# EasyEDA Pro project Clock_EasyEDA_Project_File.epro, schematic Clock

## Sheets
1 MCU: Board Name: Clock; Create Date: 2025-06-09; Page Name: MCU; Project Name: Clock; Schematic Name: Clock; Update Date: 2025-06-10; Company: (C) FEDEVEL 2025; Drawn: Robert Feranec; Page Size: A3; Part Number: JLCPCB-002; Reviewed: EasyEDA; Version: V1I1
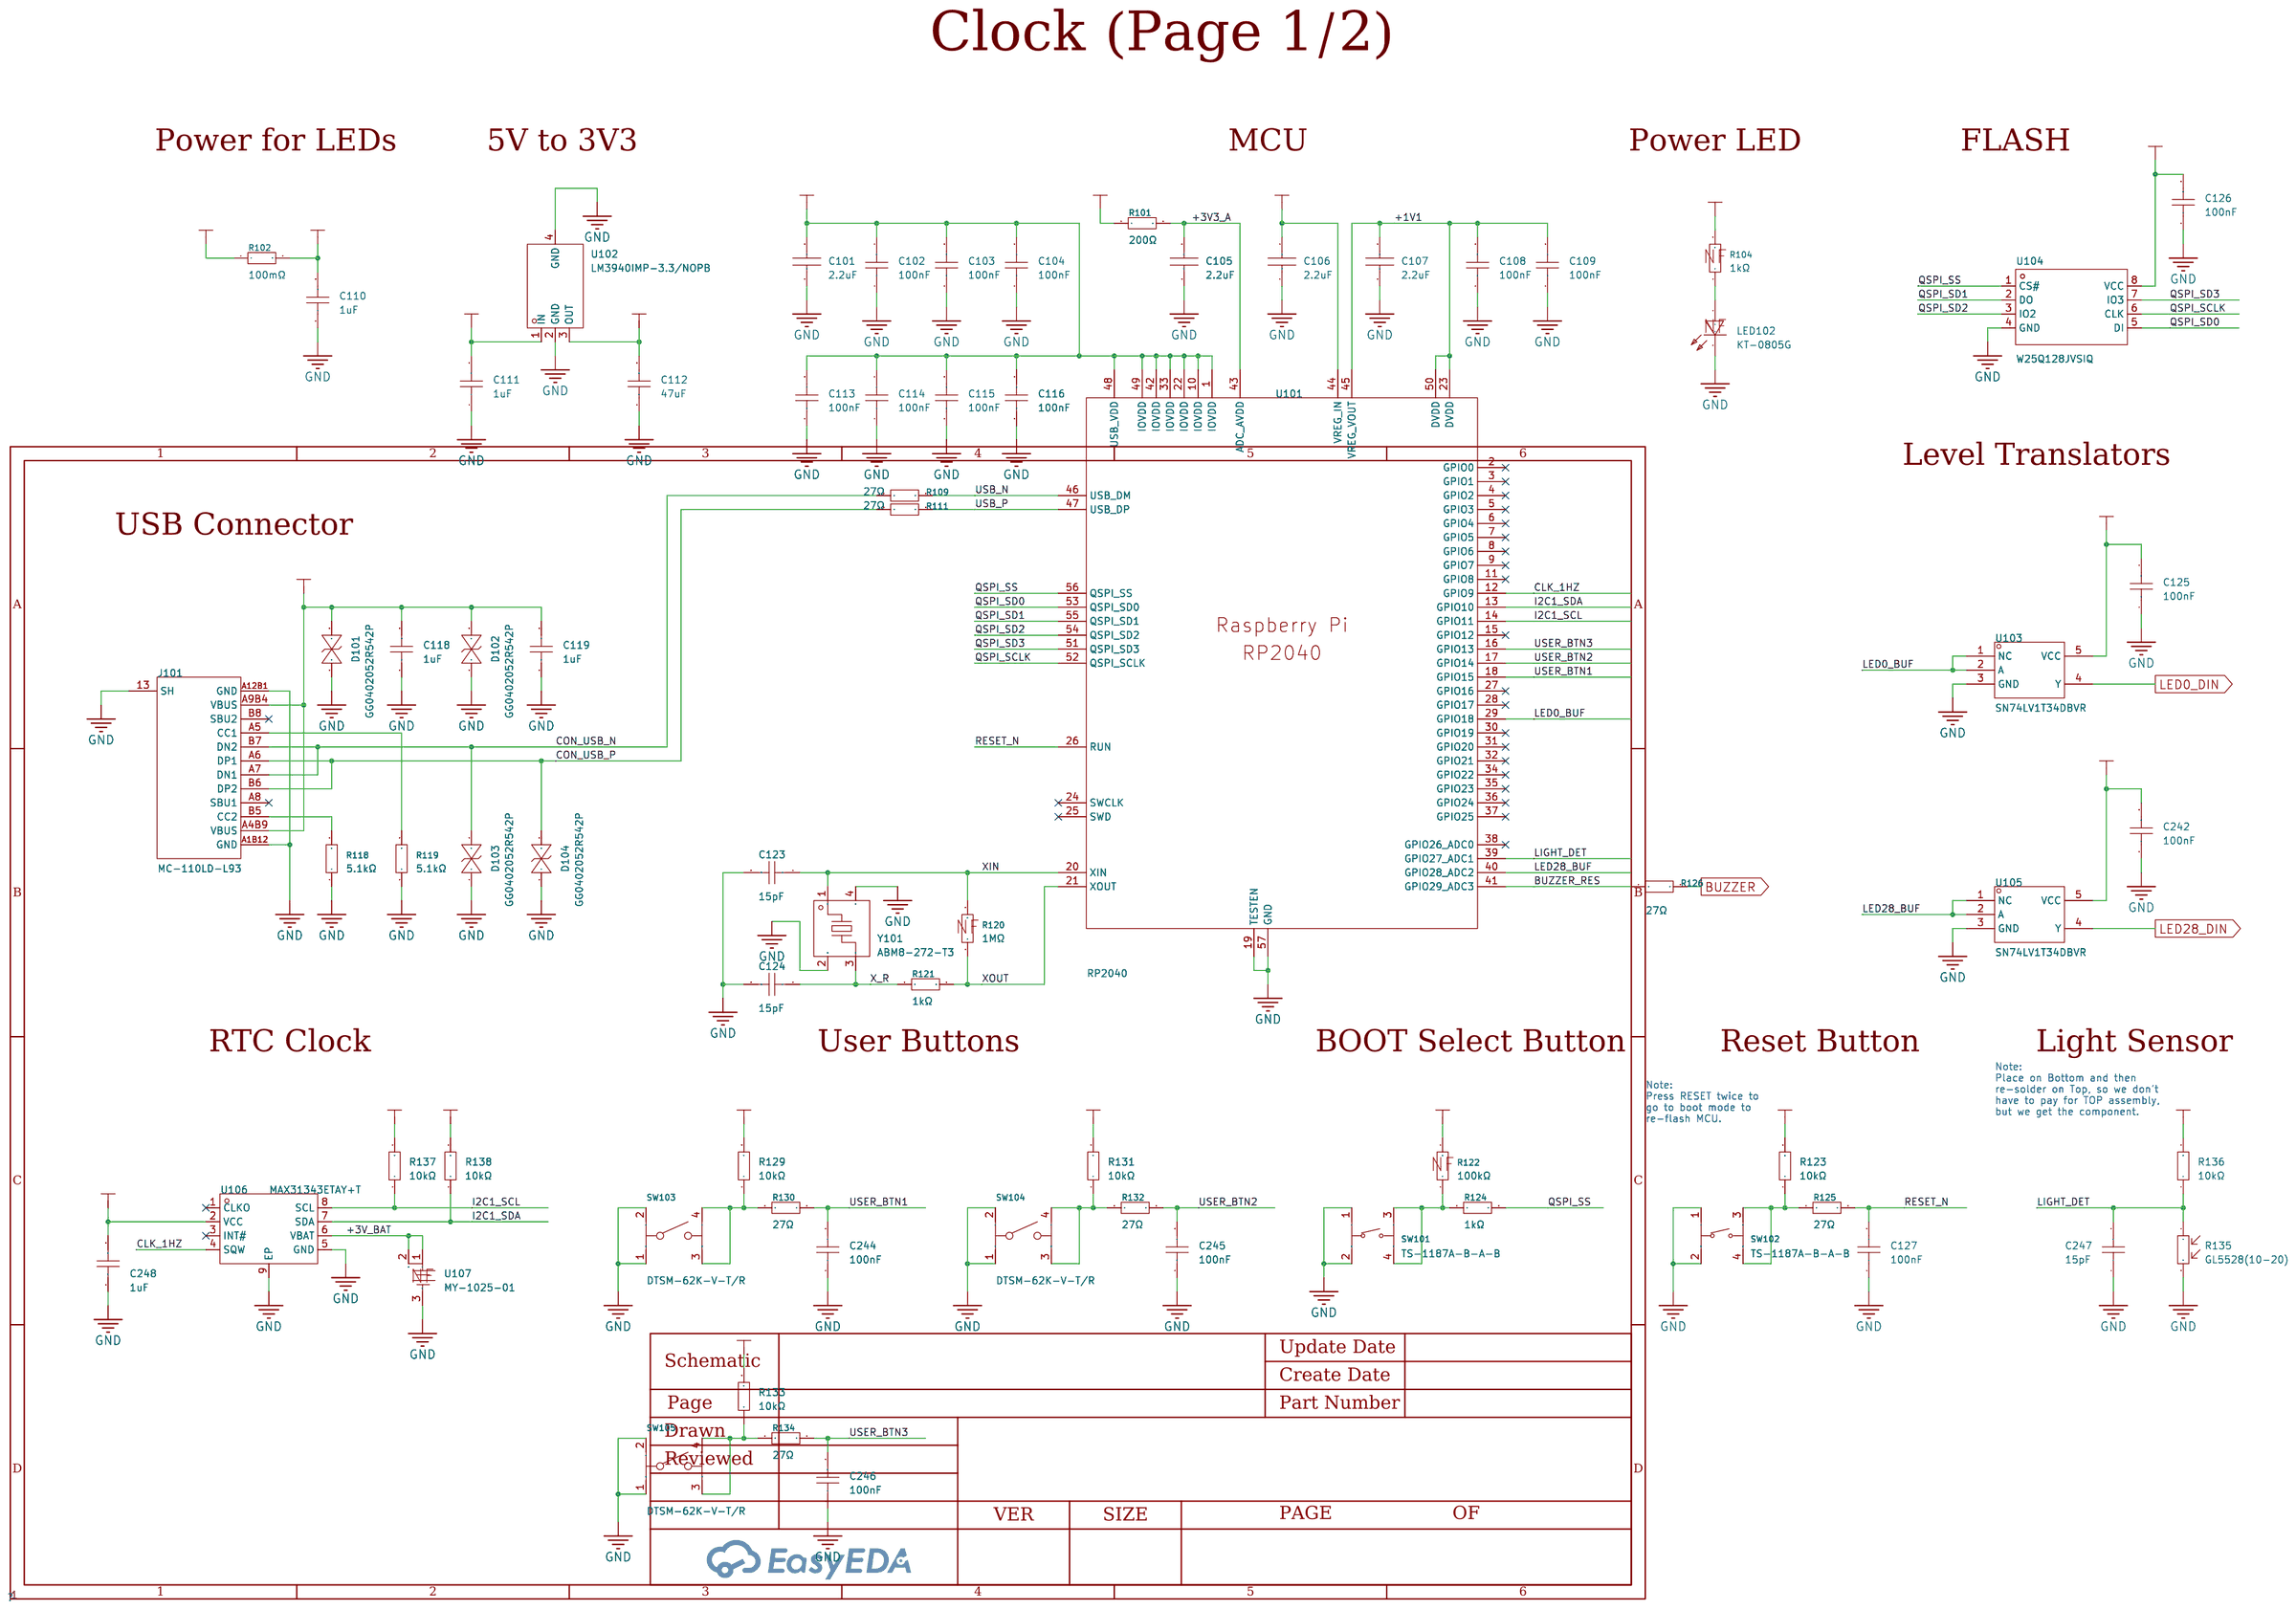
[diagram p0: MCU]
2 OTHER: Page Name: OTHER
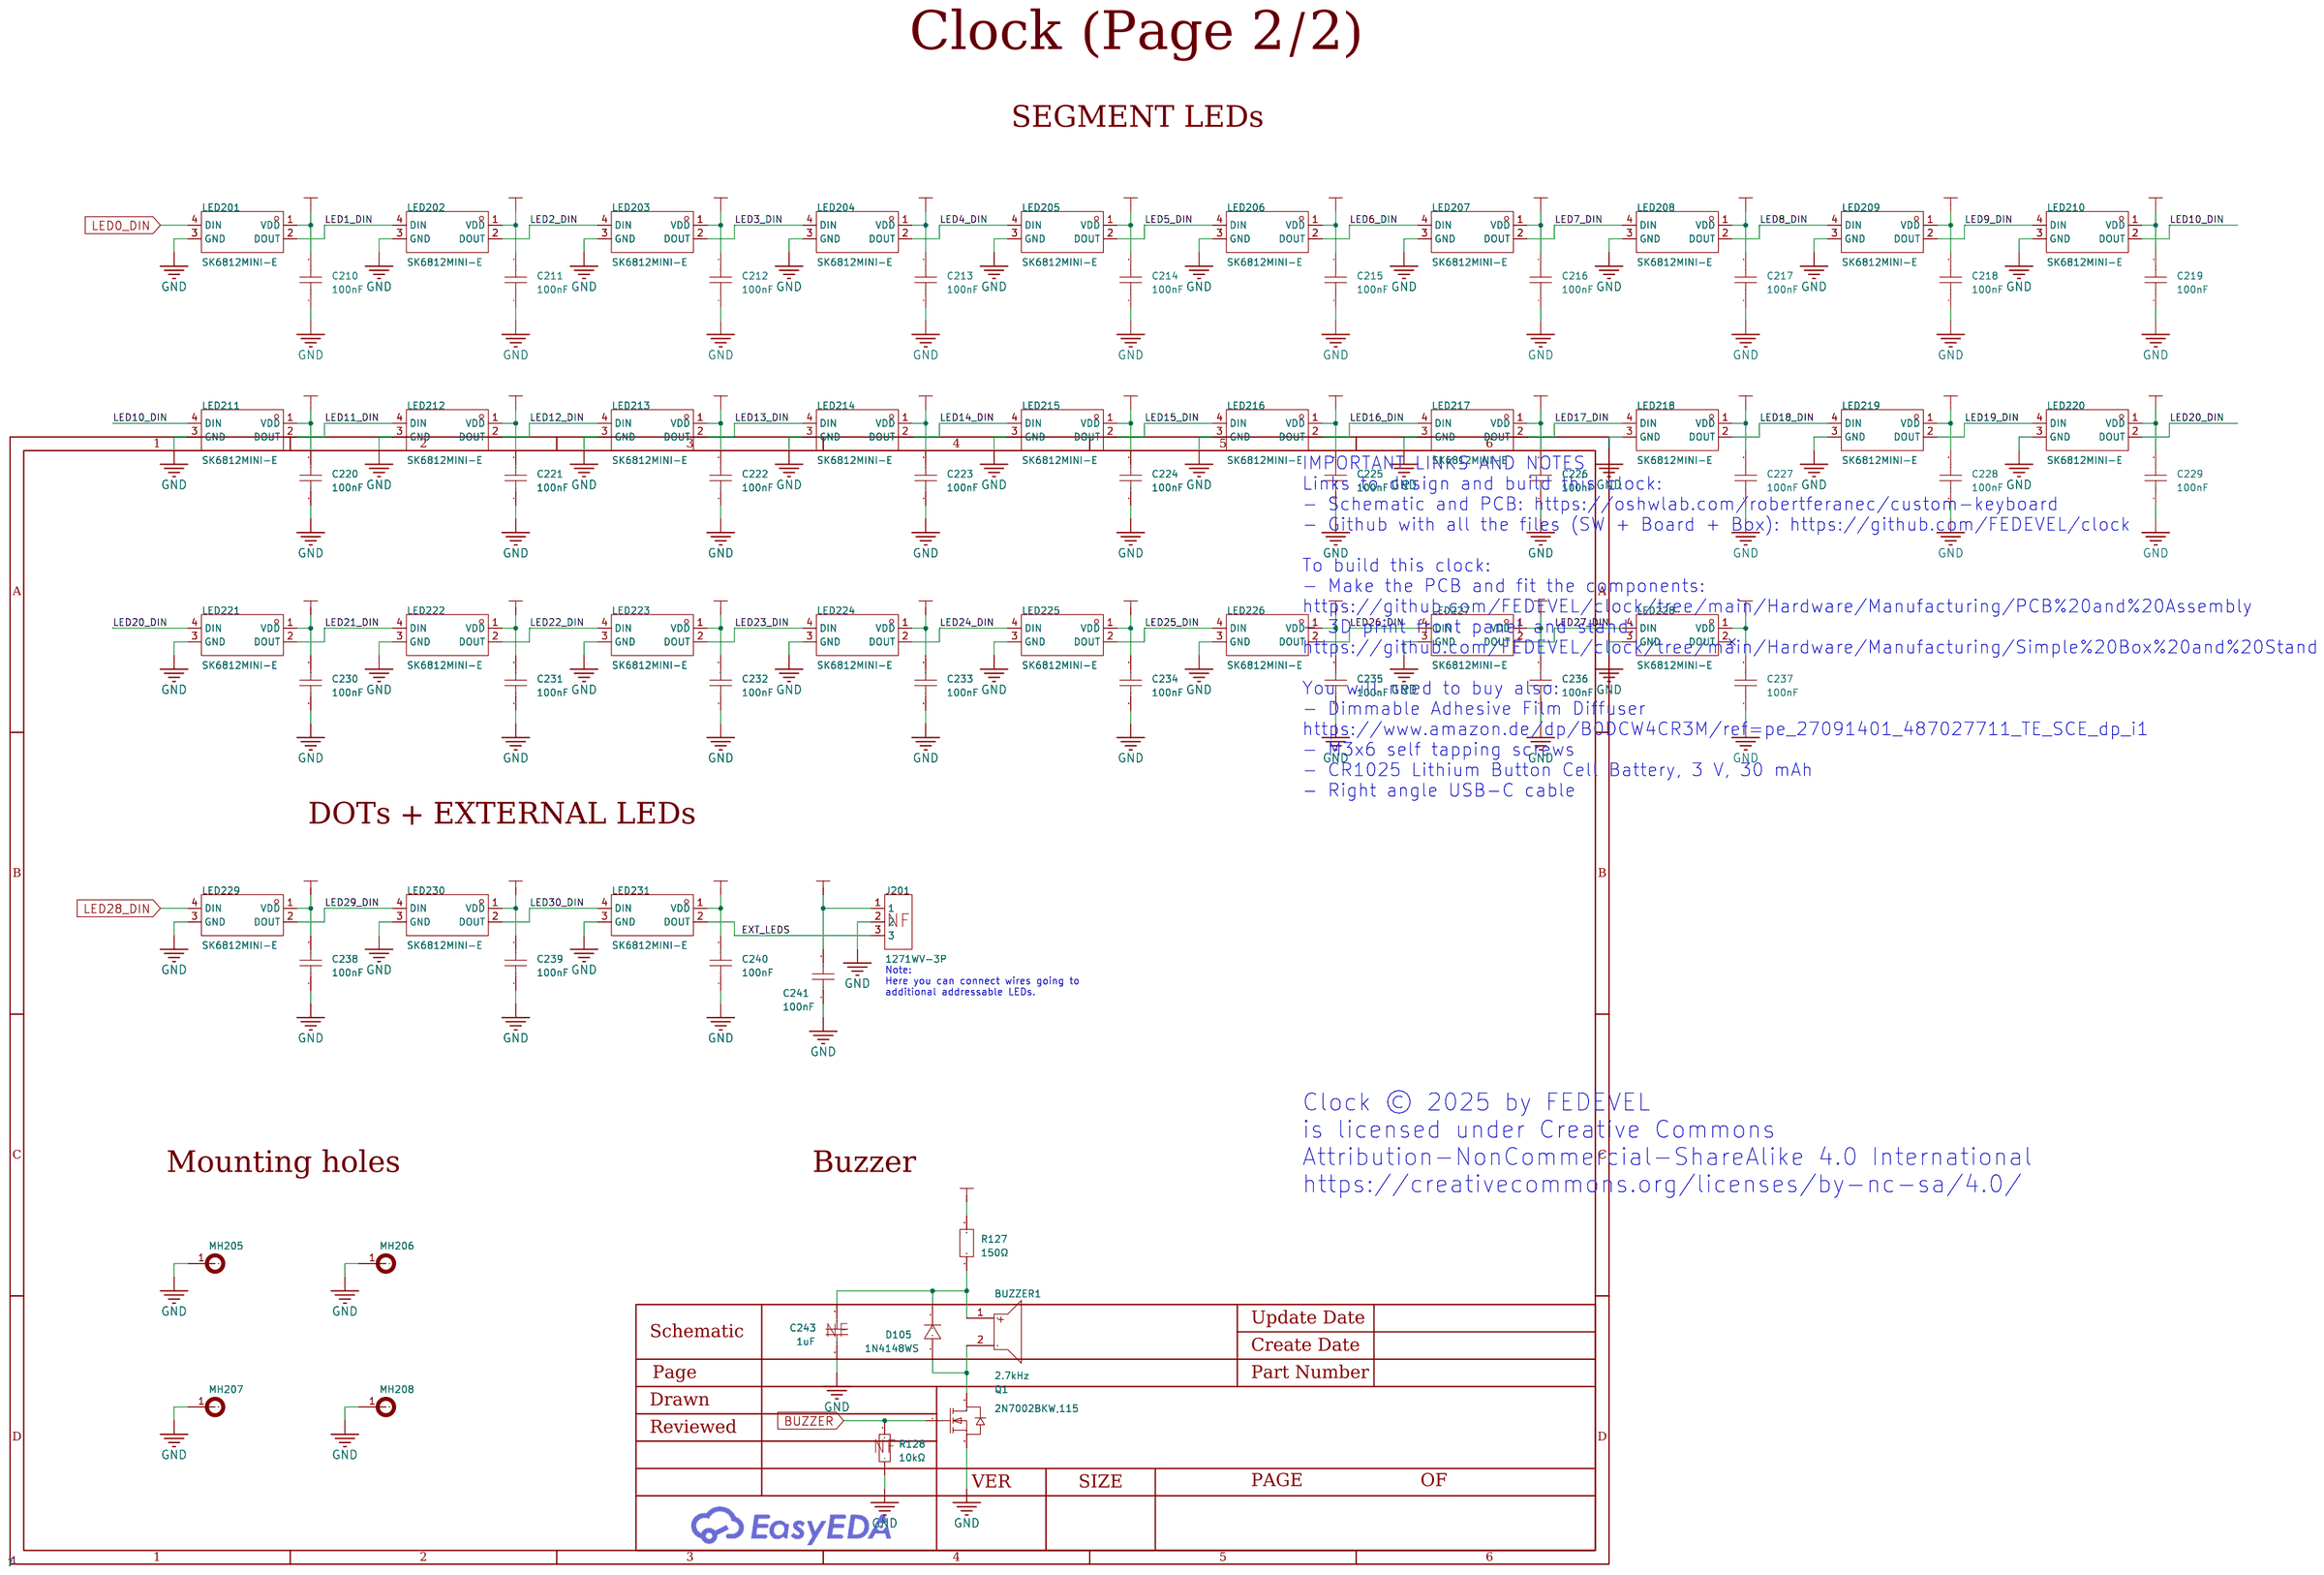
[diagram p1: OTHER]

## Parts
sheet MCU
C101  2.2uF  [C0402]
C102  100nF  [C0402]
C103  100nF  [C0402]
C104  100nF  [C0402]
C105  2.2uF  [C0402]
C106  2.2uF  [C0402]
C107  2.2uF  [C0402]
C108  100nF  [C0402]
C109  100nF  [C0402]
C110  1uF  [C0402]
C111  1uF  [C0402]
C112  47uF  [C1206]
C113  100nF  [C0402]
C114  100nF  [C0402]
C115  100nF  [C0402]
C116  100nF  [C0402]
C118  1uF  [C0402]
C119  1uF  [C0402]
C123  15pF  [C0402]
C124  15pF  [C0402]
C125  100nF  [C0402]
C126  100nF  [C0402]
C127  100nF  [C0402]
C242  100nF  [C0402]
C244  100nF  [C0402]
C245  100nF  [C0402]
C246  100nF  [C0402]
C247  15pF  [C0402]
C248  1uF  [C0402]
D101  GG0402052R542P  [D0402-BI]
D102  GG0402052R542P  [D0402-BI]
D103  GG0402052R542P  [D0402-BI]
D104  GG0402052R542P  [D0402-BI]
J101  MC-110LD-L93  [USB-C-TH_MC-110LD-L93_1]
LED102  KT-0805G  [LED0805-R-RD]  (no BOM)
R101  200Ω  [R0402]
R102  100mΩ  [R1206]
R104  1kΩ  [R0402]  (no BOM)
R109  27Ω  [R0402]
R111  27Ω  [R0402]
R118  5.1kΩ  [R0402]
R119  5.1kΩ  [R0402]
R120  1MΩ  [R0402]  (no BOM)
R121  1kΩ  [R0402]
R122  100kΩ  [R0402]  (no BOM)
R123  10kΩ  [R0402]
R124  1kΩ  [R0402]
R125  27Ω  [R0402]
R126  27Ω  [R0402]
R129  10kΩ  [R0402]
R130  27Ω  [R0402]
R131  10kΩ  [R0402]
R132  27Ω  [R0402]
R133  10kΩ  [R0402]
R134  27Ω  [R0402]
R135  GL5528(10-20)  [RES-TH_L5.1-W4.3-P3.40-D0.5]
R136  10kΩ  [R0402]
R137  10kΩ  [R0402]
R138  10kΩ  [R0402]
SW101  TS-1187A-B-A-B  [SW-SMD_4P-L5.1-W5.1-P3.70-LS6.5-TL-2]
SW102  TS-1187A-B-A-B  [SW-SMD_4P-L5.1-W5.1-P3.70-LS6.5-TL-2]
SW103  DTSM-62K-V-T/R  [KEY-SMD_4P-L6.2-W6.2-P4.50-LS9.0]
SW104  DTSM-62K-V-T/R  [KEY-SMD_4P-L6.2-W6.2-P4.50-LS9.0]
SW105  DTSM-62K-V-T/R  [KEY-SMD_4P-L6.2-W6.2-P4.50-LS9.0]
U101  RP2040  [LQFN-56_L7.0-W7.0-P0.4-EP_1]
U102  LM3940IMP-3.3/NOPB  [SOT-223_L6.5-W3.5-P2.30-LS7.0-BR]
U103  SN74LV1T34DBVR  [SOT-23-5_L2.9-W1.6-P0.95-LS2.8-BR]
U104  W25Q128JVSIQ  [SOIC-8_L5.3-W5.3-P1.27-LS8.0-BL]
U105  SN74LV1T34DBVR  [SOT-23-5_L2.9-W1.6-P0.95-LS2.8-BR]
U106  MAX31343ETAY+T  [TDFN-8_L4.0-W3.0-P0.50-BL-EP]
U107  MY-1025-01  [BAT-SMD_MY-1025-01_1]  (no BOM)
Y101  ABM8-272-T3  [CRYSTAL-SMD_4P-L3.2-W2.5-BL]
sheet OTHER
BUZZER1  2.7kHz  [BUZ-TH_BD9.0-P4.00-D0.6-FD]
C210  100nF  [C0402]
C211  100nF  [C0402]
C212  100nF  [C0402]
C213  100nF  [C0402]
C214  100nF  [C0402]
C215  100nF  [C0402]
C216  100nF  [C0402]
C217  100nF  [C0402]
C218  100nF  [C0402]
C219  100nF  [C0402]
C220  100nF  [C0402]
C221  100nF  [C0402]
C222  100nF  [C0402]
C223  100nF  [C0402]
C224  100nF  [C0402]
C225  100nF  [C0402]
C226  100nF  [C0402]
C227  100nF  [C0402]
C228  100nF  [C0402]
C229  100nF  [C0402]
C230  100nF  [C0402]
C231  100nF  [C0402]
C232  100nF  [C0402]
C233  100nF  [C0402]
C234  100nF  [C0402]
C235  100nF  [C0402]
C236  100nF  [C0402]
C237  100nF  [C0402]
C238  100nF  [C0402]
C239  100nF  [C0402]
C240  100nF  [C0402]
C241  100nF  [C0402]
C243  1uF  [C0402]  (no BOM)
D105  1N4148WS  [SOD-323_L1.8-W1.3-LS2.5-RD]
J201  1271WV-3P  [HDR-TH_3P-P1.27-V-M]  (no BOM)
LED201  SK6812MINI-E  [LED-SMD_L3.2-W2.8-TR]
LED202  SK6812MINI-E  [LED-SMD_L3.2-W2.8-TR]
LED203  SK6812MINI-E  [LED-SMD_L3.2-W2.8-TR]
LED204  SK6812MINI-E  [LED-SMD_L3.2-W2.8-TR]
LED205  SK6812MINI-E  [LED-SMD_L3.2-W2.8-TR]
LED206  SK6812MINI-E  [LED-SMD_L3.2-W2.8-TR]
LED207  SK6812MINI-E  [LED-SMD_L3.2-W2.8-TR]
LED208  SK6812MINI-E  [LED-SMD_L3.2-W2.8-TR]
LED209  SK6812MINI-E  [LED-SMD_L3.2-W2.8-TR]
LED210  SK6812MINI-E  [LED-SMD_L3.2-W2.8-TR]
LED211  SK6812MINI-E  [LED-SMD_L3.2-W2.8-TR]
LED212  SK6812MINI-E  [LED-SMD_L3.2-W2.8-TR]
LED213  SK6812MINI-E  [LED-SMD_L3.2-W2.8-TR]
LED214  SK6812MINI-E  [LED-SMD_L3.2-W2.8-TR]
LED215  SK6812MINI-E  [LED-SMD_L3.2-W2.8-TR]
LED216  SK6812MINI-E  [LED-SMD_L3.2-W2.8-TR]
LED217  SK6812MINI-E  [LED-SMD_L3.2-W2.8-TR]
LED218  SK6812MINI-E  [LED-SMD_L3.2-W2.8-TR]
LED219  SK6812MINI-E  [LED-SMD_L3.2-W2.8-TR]
LED220  SK6812MINI-E  [LED-SMD_L3.2-W2.8-TR]
LED221  SK6812MINI-E  [LED-SMD_L3.2-W2.8-TR]
LED222  SK6812MINI-E  [LED-SMD_L3.2-W2.8-TR]
LED223  SK6812MINI-E  [LED-SMD_L3.2-W2.8-TR]
LED224  SK6812MINI-E  [LED-SMD_L3.2-W2.8-TR]
LED225  SK6812MINI-E  [LED-SMD_L3.2-W2.8-TR]
LED226  SK6812MINI-E  [LED-SMD_L3.2-W2.8-TR]
LED227  SK6812MINI-E  [LED-SMD_L3.2-W2.8-TR]
LED228  SK6812MINI-E  [LED-SMD_L3.2-W2.8-TR]
LED229  SK6812MINI-E  [LED-SMD_L3.2-W2.8-TR]
LED230  SK6812MINI-E  [LED-SMD_L3.2-W2.8-TR]
LED231  SK6812MINI-E  [LED-SMD_L3.2-W2.8-TR]
MH205  -  [MH_7.5X3.2MM_RF_v1.0]  (no BOM)
MH206  -  [MH_7.5X3.2MM_RF_v1.0]  (no BOM)
MH207  -  [MH_7.5X3.2MM_RF_v1.0]  (no BOM)
MH208  -  [MH_7.5X3.2MM_RF_v1.0]  (no BOM)
Q1  2N7002BKW,115  [SOT-323_L2.0-W1.3-P1.30-LS2.1-BR]
R127  150Ω  [R1206]
R128  10kΩ  [R0402]  (no BOM)

## Library data of the parts
C101 C105-C107 = CL05A225MQ5NSNC: Capacitance: Tolerance:±20% Tolerance:±20% Voltage Rated: Temperature Coefficient:; LCSC Part Name: 2.2uF ±20% 6.3V; Supplier Part: C12530; Manufacturer: SAMSUNG(三星); Supplier Footprint: 0402; JLCPCB Part Class: Basic Part; Datasheet: https://atta.szlcsc.com/upload/public/pdf/source/20160218/1457707763339.pdf; Supplier: LCSC; Tolerance: ±20%
C102-C104 C108 C109 C113-C116 C125-C127 C210-C242 C244-C246 = CL05B104KO5NNNC: Capacitance: Tolerance:±10% Tolerance:±10% Voltage Rated: Temperature Coefficient:; LCSC Part Name: 100nF ±10% 16V; Supplier Part: C1525; Manufacturer: SAMSUNG(三星); Supplier Footprint: 0402; JLCPCB Part Class: Basic Part; Datasheet: https://atta.szlcsc.com/upload/public/pdf/source/20160218/1457707763339.pdf; Supplier: LCSC; Tolerance: ±10%
C110 C111 C118 C119 C243 C248 = CL05A105KA5NQNC: Capacitance: Tolerance:±10% Tolerance:±10% Voltage Rated: Temperature Coefficient:; LCSC Part Name: 1uF ±10% 25V; Supplier Part: C52923; Manufacturer: SAMSUNG(三星); Supplier Footprint: 0402; JLCPCB Part Class: Basic Part; Datasheet: https://atta.szlcsc.com/upload/public/pdf/source/20160218/1457707763339.pdf; Supplier: LCSC; Tolerance: ±10%
C112 = CL31A476MPHNNNE: Capacitance: Tolerance:±20% Tolerance:±20% Voltage Rated: Temperature Coefficient:; LCSC Part Name: 47uF ±20% 10V; Supplier Part: C96123; Manufacturer: SAMSUNG(三星); Supplier Footprint: 1206; JLCPCB Part Class: Basic Part; Datasheet: https://atta.szlcsc.com/upload/public/pdf/source/20160218/1457707763339.pdf; Supplier: LCSC; Tolerance: ±20%
C123 C124 C247 = CL05C150JB5NNNC: Capacitance: Tolerance:±5% Tolerance:±5% Voltage Rated: Temperature Coefficient:; LCSC Part Name: 15pF ±5% 50V; Supplier Part: C86285; Manufacturer: SAMSUNG(三星); Supplier Footprint: 0402; JLCPCB Part Class: Extended Part; Datasheet: https://atta.szlcsc.com/upload/public/pdf/source/20160218/1457707763339.pdf; Supplier: LCSC; Tolerance: ±5%
D101-D104 = GG0402052R542P: Reverse Stand-Off Voltage (Vrwm):5V Maximum Clamping Voltage:15.5V Peak Pulse Current (Ipp)@10/1000us:3A@8/20us Peak Pulse Power Dissipation (Ppp)@10/1000us:46W Breakdown Voltage:5.5V Type:TVS; LCSC Part Name: TVS 5V截止 3A峰值脉冲; Supplier Part: C1973257; Manufacturer: Kyocera AVX; Supplier Footprint: 0402; JLCPCB Part Class: Extended Part; Datasheet: https://atta.szlcsc.com/upload/public/pdf/source/20230915/02C5CA4E262376923D9117899A14A9C6.pdf; Supplier: LCSC; Reverse Stand-Off Voltage (Vrwm): 5V; Maximum Clamping Voltage: 15.5V; Peak Pulse Current (Ipp)@10/1000us: 3A@8/20us; Peak Pulse Power Dissipation (Ppp)@10/1000us: 46W; Breakdown Voltage: 5.5V; Type: TVS
J101 = MC-110LD-L93-RF: Connector Type:Type-C Standard:USB 3.1 Gender:Female Number of Ports:1 Number of Contacts:16P Mounting Style:Straight Current Rating - Power (Max):5A Contact Material:- Contact Plating:- Operating Temperature Range:-40℃~+85℃ Operating Temperature Range:-4; LCSC Part Name: Type-C 母 直插; Supplier Part: C2962413; Manufacturer: HANBO(汉博); Supplier Footprint: 插件; Datasheet: https://atta.szlcsc.com/upload/public/pdf/source/20230324/911CCC9AED4D08C5524FEEE67794B079.pdf; Supplier: LCSC; Connector Type: Type-C; Standard: USB 3.1; Gender: Female; Number of Ports: 1; Number of Contacts: 16P; Mounting Style: Straight; Current Rating - Power (Max): 5A; Operating Temperature Range: -40℃~+85℃
LED102 = KT-0805G: Lamp Holder Type:- Emitted Color:Emerald Forward Voltage (VF):- Forward Voltage (VF):- Power Dissipation:- Forward Current:- Dominant Wavelength:- Dominant Wavelength:- Peak Wavelength:- Diode Configuration:- Lens Color:- Color Temperature:- Color Tempera; LCSC Part Name: 0805 翠绿 高亮; Supplier Part: C2297; Manufacturer: KENTO; Supplier Footprint: 0805; JLCPCB Part Class: Basic Part; Datasheet: https://atta.szlcsc.com/upload/public/pdf/source/20170209/1486607340485.pdf; Supplier: LCSC; Emitted Color: Emerald
R101 = 0402WGF2000TCE: Type:Thick Film Resistors Resistance: Tolerance:±1% Tolerance:±1% Power(Watts): Overload Voltage (Max): Temperature Coefficient:±100ppm/℃ Temperature Coefficient:±100ppm/℃ Operating Temperature Range:-55℃~+155℃ Operating Temperature Range:-55℃~+155℃; LCSC Part Name: 200Ω ±1% 62.5mW 厚膜电阻; Supplier Part: C25087; Manufacturer: UNI-ROYAL(厚声); Supplier Footprint: 0402; JLCPCB Part Class: Basic Part; Datasheet: https://atta.szlcsc.com/upload/public/pdf/source/20200306/C422600_1E6D84923E4A46A82E41ADD87F860B5C.pdf; Supplier: LCSC; Type: Thick Film Resistors; Tolerance: ±1%; Temperature Coefficient: ±100ppm/℃; Operating Temperature Range: -55℃~+155℃
R102 = 1206W4F100LT5E: Type:Thick Film Resistors Resistance:100mΩ Tolerance:±1% Tolerance:±1% Power(Watts): Overload Voltage (Max): Temperature Coefficient:±800ppm/℃ Temperature Coefficient:±800ppm/℃ Operating Temperature Range:-55℃~+155℃ Operating Temperature Range:-55℃~+155℃; LCSC Part Name: 100mΩ ±1% 250mW 厚膜电阻; Supplier Part: C25334; Manufacturer: UNI-ROYAL(厚声); Supplier Footprint: 1206; JLCPCB Part Class: Basic Part; Datasheet: https://atta.szlcsc.com/upload/public/pdf/source/20200306/C422600_1E6D84923E4A46A82E41ADD87F860B5C.pdf; Supplier: LCSC; Type: Thick Film Resistors; Tolerance: ±1%; Temperature Coefficient: ±800ppm/℃; Operating Temperature Range: -55℃~+155℃
R104 R121 R124 = 0402WGF1001TCE: Type:Thick Film Resistors Resistance:1kΩ Tolerance:±1% Tolerance:±1% Power(Watts): Overload Voltage (Max): Temperature Coefficient:±100ppm/℃ Temperature Coefficient:±100ppm/℃ Operating Temperature Range:-55℃~+155℃ Operating Temperature Range:-55℃~+155℃; LCSC Part Name: 1kΩ ±1% 62.5mW 厚膜电阻; Supplier Part: C11702; Manufacturer: UNI-ROYAL(厚声); Supplier Footprint: 0402; JLCPCB Part Class: Basic Part; Datasheet: https://atta.szlcsc.com/upload/public/pdf/source/20200306/C422600_1E6D84923E4A46A82E41ADD87F860B5C.pdf; Supplier: LCSC; Type: Thick Film Resistors; Tolerance: ±1%; Temperature Coefficient: ±100ppm/℃; Operating Temperature Range: -55℃~+155℃
R109 R111 R125 R126 R130 R132 R134 = 0402WGF270JTCE: Type:Thick Film Resistors Resistance:27Ω Tolerance:±1% Tolerance:±1% Power(Watts): Overload Voltage (Max): Temperature Coefficient:±100ppm/℃ Temperature Coefficient:±100ppm/℃ Operating Temperature Range:-55℃~+155℃ Operating Temperature Range:-55℃~+155℃; LCSC Part Name: 27Ω ±1% 62.5mW 厚膜电阻; Supplier Part: C25100; Manufacturer: UNI-ROYAL(厚声); Supplier Footprint: 0402; JLCPCB Part Class: Extended Part; Datasheet: https://atta.szlcsc.com/upload/public/pdf/source/20200306/C422600_1E6D84923E4A46A82E41ADD87F860B5C.pdf; Supplier: LCSC; Type: Thick Film Resistors; Tolerance: ±1%; Temperature Coefficient: ±100ppm/℃; Operating Temperature Range: -55℃~+155℃
R118 R119 = 0402WGF5101TCE: Type:Thick Film Resistors Resistance:5.1kΩ Tolerance:±1% Tolerance:±1% Power(Watts): Overload Voltage (Max): Temperature Coefficient:±100ppm/℃ Temperature Coefficient:±100ppm/℃ Operating Temperature Range:-55℃~+155℃ Operating Temperature Range:-55℃~+155℃; LCSC Part Name: 5.1kΩ ±1% 62.5mW 厚膜电阻; Supplier Part: C25905; Manufacturer: UNI-ROYAL(厚声); Supplier Footprint: 0402; JLCPCB Part Class: Basic Part; Datasheet: https://atta.szlcsc.com/upload/public/pdf/source/20200306/C422600_1E6D84923E4A46A82E41ADD87F860B5C.pdf; Supplier: LCSC; Type: Thick Film Resistors; Tolerance: ±1%; Temperature Coefficient: ±100ppm/℃; Operating Temperature Range: -55℃~+155℃
R120 = 0402WGF1004TCE: Type:Thick Film Resistors Resistance:1MΩ Tolerance:±1% Tolerance:±1% Power(Watts): Overload Voltage (Max): Temperature Coefficient:±100ppm/℃ Temperature Coefficient:±100ppm/℃ Operating Temperature Range:-55℃~+155℃ Operating Temperature Range:-55℃~+155℃; LCSC Part Name: 1MΩ ±1% 62.5mW 厚膜电阻; Supplier Part: C26083; Manufacturer: UNI-ROYAL(厚声); Supplier Footprint: 0402; JLCPCB Part Class: Basic Part; Datasheet: https://atta.szlcsc.com/upload/public/pdf/source/20200306/C422600_1E6D84923E4A46A82E41ADD87F860B5C.pdf; Supplier: LCSC; Type: Thick Film Resistors; Tolerance: ±1%; Temperature Coefficient: ±100ppm/℃; Operating Temperature Range: -55℃~+155℃
R122 = 0402WGF1003TCE: Type:Thick Film Resistors Resistance:100kΩ Tolerance:±1% Tolerance:±1% Power(Watts): Overload Voltage (Max): Temperature Coefficient:±100ppm/℃ Temperature Coefficient:±100ppm/℃ Operating Temperature Range:-55℃~+155℃ Operating Temperature Range:-55℃~+155℃; LCSC Part Name: 100kΩ ±1% 62.5mW 厚膜电阻; Supplier Part: C25741; Manufacturer: UNI-ROYAL(厚声); Supplier Footprint: 0402; JLCPCB Part Class: Basic Part; Datasheet: https://atta.szlcsc.com/upload/public/pdf/source/20200306/C422600_1E6D84923E4A46A82E41ADD87F860B5C.pdf; Supplier: LCSC; Type: Thick Film Resistors; Tolerance: ±1%; Temperature Coefficient: ±100ppm/℃; Operating Temperature Range: -55℃~+155℃
R123 R128 R129 R131 R133 R136-R138 = 0402WGF1002TCE: Type:Thick Film Resistors Resistance:10kΩ Tolerance:±1% Tolerance:±1% Power(Watts): Overload Voltage (Max): Temperature Coefficient:±100ppm/℃ Temperature Coefficient:±100ppm/℃ Operating Temperature Range:-55℃~+155℃ Operating Temperature Range:-55℃~+155℃; LCSC Part Name: 10kΩ ±1% 62.5mW 厚膜电阻; Supplier Part: C25744; Manufacturer: UNI-ROYAL(厚声); Supplier Footprint: 0402; JLCPCB Part Class: Basic Part; Datasheet: https://atta.szlcsc.com/upload/public/pdf/source/20200306/C422600_1E6D84923E4A46A82E41ADD87F860B5C.pdf; Supplier: LCSC; Type: Thick Film Resistors; Tolerance: ±1%; Temperature Coefficient: ±100ppm/℃; Operating Temperature Range: -55℃~+155℃
R135 = GL5528(10-20)_C10081: Dark Resistance: Cell Resistance @ Illuminance:10kΩ~20kΩ Cell Resistance @ Illuminance:10kΩ~20kΩ Voltage - Max:150V Wavelength - Peak:; Supplier Part: C10081; Manufacturer: JCHL(晶创和立); Supplier Footprint: 插件,P=3.4mm; JLCPCB Part Class: Extended Part; Datasheet: https://atta.szlcsc.com/upload/public/pdf/source/20200417/C515010_C10502EF7F431E893A7F20DB83F527F0.pdf; Supplier: LCSC; Cell Resistance @ Illuminance: 10kΩ~20kΩ; Voltage - Max: 150V
SW101 SW102 = TS-1187A-B-A-B: Circuit:SPST Actuator Style:Round Button Operating Force:160gf Mounting Style:Brick nogging Switch Length:5.1mm Switch Width:5.1mm Switch Height:1.5mm Strike Gundam:不带 Contact Current:50mA Voltage Rating (DC):12V Insulation Resistance:- Actuator/Cap Color; LCSC Part Name: 5.1*5.1*1.5mm 立贴 轻触开关; Supplier Part: C318884; Manufacturer: XKB Connectivity(中国星坤); Supplier Footprint: SMD; JLCPCB Part Class: Basic Part; Datasheet: https://atta.szlcsc.com/upload/public/pdf/source/20200227/C318890_053E50208A88A7BA1965D8746000774E.pdf; Supplier: LCSC; Circuit: SPST; Actuator Style: Round Button; Operating Force: 160gf; Mounting Style: Brick nogging; Switch Length: 5.1mm; Switch Width: 5.1mm; Switch Height: 1.5mm; Strike Gundam: 不带; Contact Current: 50mA; Voltage Rating (DC): 12V; Actuator/Cap Color: 金色; With Lamp: No; Mechanical Life: 10万次; Operating Temperature: -30℃~+85℃
SW103-SW105 = DTSM-62K-V-T/R: Circuit:SPST Actuator Style:Round Button Mounting Style:- Switch Length:6.2mm Switch Width:6.2mm Switch Height:5mm Contact Current:50mA Voltage Rating (DC):12V With Lamp:- Mechanical Life:-; LCSC Part Name: 贴片 行程0.25mm 100gf; Supplier Part: C224978; Manufacturer: 圜达; Supplier Footprint: SMD-4P,6.2x6.2mm; JLCPCB Part Class: Extended Part; Datasheet: https://atta.szlcsc.com/upload/public/pdf/source/20180517/C224978_9A4191BD3D4F17D818D413C136BB44B3.pdf; Supplier: LCSC; Circuit: SPST; Actuator Style: Round Button; Switch Length: 6.2mm; Switch Width: 6.2mm; Switch Height: 5mm; Contact Current: 50mA; Voltage Rating (DC): 12V
U101 = RP2040_C2040_RF_v1.0: CPU Core:- RAM Size:264KB GPIO Ports Number:30 Operating Voltage Range:- Operating Voltage Range:- CPU Maximum Speed:133MHz Program Memory Type:- Operating Temperature Range:- Operating Temperature Range:- ADC (Bit):12bit DAC (Bit):- PWM (Bit):- 8Bit Time; LCSC Part Name: RP2040（RP2B2）; Supplier Part: C2040; Manufacturer: Raspberry Pi(树莓派); Supplier Footprint: LQFN-56(7x7); Datasheet: https://atta.szlcsc.com/upload/public/pdf/source/20210621/C2040_96F425825606B7957D87DD32E2512CA9.pdf; Supplier: LCSC; RAM Size: 264KB; GPIO Ports Number: 30; CPU Maximum Speed: 133MHz; ADC (Bit): 12bit; UART/USART: 2; I2C: 2; SPI: 2; Universal Serial Bus: 有; Peripheral/Function: DMA；PWM; Direct Memory Access: 有
U102 = LM3940IMP-3.3/NOPB: Output Type:Fixed Maximum Input Voltage:7.5V Output Voltage:3.3V Output Voltage:3.3V Output Current:1A Power Supply Rejection Ratio (PSRR):- Dropout Voltage:200mV@(100mA) Feature:防静电保护；Short-Circuit  Protection；低ESR；Thermal Protection(TSD)；Overcurrent Pro; LCSC Part Name: 用于 5V 至 3.3V 电压转换的 1A 低压降稳压器; Supplier Part: C140319; Manufacturer: TI(德州仪器); Supplier Footprint: SOT-223; JLCPCB Part Class: Extended Part; Datasheet: https://www.ti.com/cn/lit/gpn/lm3940; Supplier: LCSC; Output Type: Fixed; Maximum Input Voltage: 7.5V; Output Voltage: 3.3V; Output Current: 1A; Dropout Voltage: 200mV@(100mA); Feature: 防静电保护；Short-Circuit  Protection；低ESR；Thermal Protection(TSD)；Overcurrent Protection(OCP)；带使能; Operating Temperature: -40℃~+125℃; Output Polarity: Positive electrode; Number of Outputs: 1
U103 U105 = SN74LV1T34DBVR_RF_v1.0: Input type:- output type:推挽 Supply Voltage:1.6V~5.5V Supply Voltage:1.6V~5.5V Number of Elements:1 Number of Bits per Element:1 Sink Current:8mA Source Current:8mA Logic Family:74LV Operating Temperature:-40℃~+125℃ Operating Temperature:-40℃~+125℃; Supplier Part: C100024; Manufacturer: TI(德州仪器); Supplier Footprint: SOT-23-5; Datasheet: https://www.ti.com/cn/lit/gpn/sn74lv1t34; Supplier: LCSC; output type: 推挽; Supply Voltage: 1.6V~5.5V; Number of Elements: 1; Number of Bits per Element: 1; Sink Current: 8mA; Source Current: 8mA; Logic Family: 74LV; Operating Temperature: -40℃~+125℃
U104 = W25Q128JVSIQ: Interface Type:- Memory Size:128Mbit Clock Frequency (fc):- Supply Voltage:- Supply Voltage:- Page Programming Time (Tpp):- Block Erase Time (tBE):- Data Retention - TDR (Year):- Operating Temperature:- Operating Temperature:-; LCSC Part Name: W25Q128JVSIQ 编带; Supplier Part: C97521; Manufacturer: WINBOND(华邦); Supplier Footprint: SOIC-8-208mil; JLCPCB Part Class: Basic Part; Datasheet: https://atta.szlcsc.com/upload/public/pdf/source/20170316/1489627409956.pdf; Supplier: LCSC; Memory Size: 128Mbit
U106 = MAX31343ETAY+T: Interface:I2C Voltage - Supply:1.6V~5.5V Voltage - Supply:1.6V~5.5V crystal oscillator:Built-in Operating Temperature:-40℃~+85℃ Operating Temperature:-40℃~+85℃; LCSC Part Name: ±5ppm，集成MEMS振荡器的I2C实时时钟; Supplier Part: C7458635; Manufacturer: ADI(亚德诺)/MAXIM(美信); Supplier Footprint: WLP-8(2.1x2.3); JLCPCB Part Class: Extended Part; Datasheet: https://atta.szlcsc.com/upload/public/pdf/source/20230919/9ADAC0F5B47583FBDFB36503495385BE.pdf; Supplier: LCSC; Interface: I2C; Voltage - Supply: 1.6V~5.5V; crystal oscillator: Built-in; Operating Temperature: -40℃~+85℃
U107 = MY-1025-01-RF: Connector Type:Battery clip Battery Type:CR1025 Contact Material:Phosphor Bronze Contact Plating:Nickel; LCSC Part Name: 电池扣 适用电池:CR1025; Supplier Part: C5457114; Manufacturer: MYOUNG(美阳); Supplier Footprint: SMD; JLCPCB Part Class: Extended Part; Datasheet: https://atta.szlcsc.com/upload/public/pdf/source/20230523/77CF2AEC9BE2AF25EB5C58E5F3B62F21.pdf; Supplier: LCSC; Connector Type: Battery clip; Battery Type: CR1025; Contact Material: Phosphor Bronze; Contact Plating: Nickel
Y101 = ABM8-272-T3_C20625731: Supplier Part: C20625731; Manufacturer: ABRACON; Supplier Footprint: SMD3225-4P; JLCPCB Part Class: Extended Part; Datasheet: https://atta.szlcsc.com/upload/public/pdf/source/20240227/A8BE43F636D80F75C9AF5C59EDF21E9A.pdf; Supplier: LCSC
BUZZER1 = QMB-09B-03: Driver Circuitry:Passive (external drive) Technology:Electromagnetic Type Voltage - Supply:2V~5V Voltage - Supply:2V~5V Frequency:2.7kHz Sound Pressure Level(SPL):85dB Diameter(φD):9mm Height:5.7mm; LCSC Part Name: 无源蜂鸣器QMB-09B-03; Supplier Part: C96256; Manufacturer: 华能; Supplier Footprint: 插件,D=9mm; JLCPCB Part Class: Extended Part; Datasheet: https://atta.szlcsc.com/upload/public/pdf/source/20210401/C96256_958B17753B5AD7CBFBCFFC7C095B4484.pdf; Supplier: LCSC; Driver Circuitry: Passive (external drive); Technology: Electromagnetic Type; Voltage - Supply: 2V~5V; Sound Pressure Level(SPL): 85dB; Diameter(φD): 9mm; Height: 5.7mm
D105 = 1N4148WS_C2128: Diode Configuration:Independent Type Voltage - Forward(Vf@If):1.25V@150mA Voltage - DC Reverse(Vr):100V Current - Rectified:150mA Reverse Leakage Current (Ir):1uA@75V Reverse Recovery Time (trr):4ns Operating Temperature:- Operating Temperature:-; LCSC Part Name: 丝印T4 1N4148WS; Supplier Part: C2128; Manufacturer: CJ(江苏长电/长晶); Supplier Footprint: SOD-323; JLCPCB Part Class: Basic Part; Datasheet: https://atta.szlcsc.com/upload/public/pdf/source/20140809/1457707208178.pdf; Supplier: LCSC; Diode Configuration: Independent Type; Voltage - Forward(Vf@If): 1.25V@150mA; Voltage - DC Reverse(Vr): 100V; Current - Rectified: 150mA; Reverse Leakage Current (Ir): 1uA@75V; Reverse Recovery Time (trr): 4ns
J201 = 1271WV-3P: Pin Structure:1x3P Pitch:1.27mm Circluar Pins/Square Pins:Policy Mounting Type:Straight Number of Rows:Single Row Number of Pins:3P Length of Mating Pin:4mm Insulation Height:1mm Length of End Connection Pin:2.2mm Contact Plating:Gold Operating Temperatur; LCSC Part Name: 1x3P 间距:1.27mm 方针 直插; Supplier Part: C7470079; Manufacturer: HanElectricity(瀚源); Supplier Footprint: 插件,P=1.27mm; JLCPCB Part Class: Extended Part; Datasheet: https://atta.szlcsc.com/upload/public/pdf/source/20230725/C20F4E8AA455A91903D6D6B88966FE30.pdf; Supplier: LCSC; Pin Structure: 1x3P; Pitch: 1.27mm; Circluar Pins/Square Pins: Policy; Mounting Type: Straight; Number of Rows: Single Row; Number of Pins: 3P; Length of Mating Pin: 4mm; Insulation Height: 1mm; Length of End Connection Pin: 2.2mm; Contact Plating: Gold; Operating Temperature: -40℃~+105℃
LED201-LED231 = SK6812MINI-E_C5149201: Supplier Part: C5149201; Manufacturer: 欧思科光电; Supplier Footprint: SMD; JLCPCB Part Class: Extended Part; Datasheet: https://atta.szlcsc.com/upload/public/pdf/source/20240708/7577C013CD62BC7D192EAA1AF5B38052.pdf; Supplier: LCSC
MH205-MH208 = MH_7.5X3.2MM_RF_v1.0
Q1 = 2N7002BKW,115: Type:1 N-Channel Drain Source Voltage (Vdss): Continuous Drain Current (Id): Drain Source On Resistance (RDS(on)@Vgs,Id):1.6Ω@10V,500mA Power Dissipation (Pd): Gate Threshold Voltage (Vgs(th)@Id):2.1V@250uA Total Gate Charge (Qg@Vgs):600pC@4.5V Input Capa; LCSC Part Name: 1个N沟道 耐压:60V 电流:310mA; Supplier Part: C455035; Manufacturer: Nexperia(安世); Supplier Footprint: SOT-323-3; JLCPCB Part Class: Extended Part; Datasheet: https://atta.szlcsc.com/upload/public/pdf/source/20191114/C455035_DF4B6FCCFA6792AC95B1E523EEC63B57.pdf; Supplier: LCSC; Type: 1 N-Channel; Drain Source On Resistance (RDS(on)@Vgs,Id): 1.6Ω@10V,500mA; Gate Threshold Voltage (Vgs(th)@Id): 2.1V@250uA; Total Gate Charge (Qg@Vgs): 600pC@4.5V; Input Capacitance (Ciss@Vds): 50pF@10V
R127 = AS0606J0151T5E_C966083: Type:Thick Film Resistors Resistance: Tolerance:±5% Tolerance:±5% Power(Watts): Voltage-Supply(Max): Temperature Coefficient:±100ppm/℃ Temperature Coefficient:±100ppm/℃ Operating Temperature:-55℃~+155℃ Operating Temperature:-55℃~+155℃; LCSC Part Name: 150Ω ±5% 600mW 厚膜电阻; Supplier Part: C966083; Manufacturer: UNI-ROYAL(厚声); Manufacturer Part: AS0606J0151T5E; Supplier Footprint: 1206; JLCPCB Part Class: Extended Part; Datasheet: https://atta.szlcsc.com/upload/public/pdf/source/20200723/C560412_34ABBCC623B52ADD707B94178459E29E.pdf; Supplier: LCSC; Type: Thick Film Resistors; Tolerance: ±5%; Temperature Coefficient: ±100ppm/℃; Operating Temperature: -55℃~+155℃

## Nets
+1V1: C107.2 C108.2 C109.2 U101.23(DVDD) U101.45(VREG_VOUT) U101.50(DVDD)
+3V3: C101.2 C102.2 C103.2 C104.2 C106.2 C112.2 C113.2 C114.2 C115.2 C116.2 C126.2 C248.2 R101.1 R104.2 R122.2 R123.2 R129.2 R131.2 R133.2 R136.2 R137.2 R138.2 U101.1(IOVDD) U101.10(IOVDD) U101.22(IOVDD) U101.33(IOVDD) U101.42(IOVDD) U101.44(VREG_IN) U101.48(USB_VDD) U101.49(IOVDD) U102.3(OUT) U104.8(VCC) U106.2(VCC)
+3V3_A: C105.2 R101.2 U101.43(ADC_AVDD)
+3V_BAT: U106.6(VBAT) U107.1 U107.2
+5V_LEDS: C110.2 C210.2 C211.2 C212.2 C213.2 C214.2 C215.2 C216.2 C217.2 C218.2 C219.2 C220.2 C221.2 C222.2 C223.2 C224.2 C225.2 C226.2 C227.2 C228.2 C229.2 C230.2 C231.2 C232.2 C233.2 C234.2 C235.2 C236.2 C237.2 C238.2 C239.2 C240.2 C241.2 J201.1 LED201.1(VDD) LED202.1(VDD) LED203.1(VDD) LED204.1(VDD) LED205.1(VDD) LED206.1(VDD) LED207.1(VDD) LED208.1(VDD) LED209.1(VDD) LED210.1(VDD) LED211.1(VDD) LED212.1(VDD) LED213.1(VDD) LED214.1(VDD) LED215.1(VDD) LED216.1(VDD) LED217.1(VDD) LED218.1(VDD) LED219.1(VDD) LED220.1(VDD) LED221.1(VDD) LED222.1(VDD) LED223.1(VDD) LED224.1(VDD) LED225.1(VDD) LED226.1(VDD) LED227.1(VDD) LED228.1(VDD) LED229.1(VDD) LED230.1(VDD) LED231.1(VDD) R102.2
+5V_USB: C111.2 C118.2 C119.2 C125.2 C242.2 D101.2 D102.2 J101.A4B9(VBUS) J101.A9B4(VBUS) R102.1 R127.2 U102.1(IN) U103.5(VCC) U105.5(VCC)
GND: C101.1 C102.1 C103.1 C104.1 C105.1 C106.1 C107.1 C108.1 C109.1 C110.1 C111.1 C112.1 C113.1 C114.1 C115.1 C116.1 C118.1 C119.1 C123.2 C124.2 C125.1 C126.1 C127.1 C210.1 C211.1 C212.1 C213.1 C214.1 C215.1 C216.1 C217.1 C218.1 C219.1 C220.1 C221.1 C222.1 C223.1 C224.1 C225.1 C226.1 C227.1 C228.1 C229.1 C230.1 C231.1 C232.1 C233.1 C234.1 C235.1 C236.1 C237.1 C238.1 C239.1 C240.1 C241.1 C242.1 C243.1 C244.1 C245.1 C246.1 C247.1 C248.1 D101.1 D102.1 D103.1 D104.1 J101.13(SH) J101.A1B12(GND) J101.A12B1(GND) J201.2 LED102.2(K) LED201.3(GND) LED202.3(GND) LED203.3(GND) LED204.3(GND) LED205.3(GND) LED206.3(GND) LED207.3(GND) LED208.3(GND) LED209.3(GND) LED210.3(GND) LED211.3(GND) LED212.3(GND) LED213.3(GND) LED214.3(GND) LED215.3(GND) LED216.3(GND) LED217.3(GND) LED218.3(GND) LED219.3(GND) LED220.3(GND) LED221.3(GND) LED222.3(GND) LED223.3(GND) LED224.3(GND) LED225.3(GND) LED226.3(GND) LED227.3(GND) LED228.3(GND) LED229.3(GND) LED230.3(GND) LED231.3(GND) MH205.1 MH206.1 MH207.1 MH208.1 Q1.2(S) R118.1 R119.1 R128.1 R135.2 SW101.1(A) SW101.2(B) SW102.1(A) SW102.2(B) SW103.1 SW103.2 SW104.1 SW104.2 SW105.1 SW105.2 U101.19(TESTEN) U101.57(GND) U102.2(GND) U102.4(GND) U103.3(GND) U104.4(GND) U105.3(GND) U106.5(GND) U106.9(EP) U107.3 Y101.2(GND) Y101.4(GND)
BUZZER: Q1.1(G) R126.2 R128.2
BUZZER_RES: R126.1 U101.41(GPIO29_ADC3)
CLK_1HZ: U101.12(GPIO9) U106.4(SQW)
CON_USB_N: D103.2 J101.A7(DN1) J101.B7(DN2) R109.1
CON_USB_P: D104.2 J101.A6(DP1) J101.B6(DP2) R111.1
EXT_LEDS: J201.3 LED231.2(DOUT)
I2C1_SCL: R137.1 U101.14(GPIO11) U106.8(SCL)
I2C1_SDA: R138.1 U101.13(GPIO10) U106.7(SDA)
LED0_BUF: U101.29(GPIO18) U103.1(NC) U103.2(A)
LED0_DIN: LED201.4(DIN) U103.4(Y)
LED1_DIN: LED201.2(DOUT) LED202.4(DIN)
LED2_DIN: LED202.2(DOUT) LED203.4(DIN)
LED3_DIN: LED203.2(DOUT) LED204.4(DIN)
LED4_DIN: LED204.2(DOUT) LED205.4(DIN)
LED5_DIN: LED205.2(DOUT) LED206.4(DIN)
LED6_DIN: LED206.2(DOUT) LED207.4(DIN)
LED7_DIN: LED207.2(DOUT) LED208.4(DIN)
LED8_DIN: LED208.2(DOUT) LED209.4(DIN)
LED9_DIN: LED209.2(DOUT) LED210.4(DIN)
LED10_DIN: LED210.2(DOUT) LED211.4(DIN)
LED11_DIN: LED211.2(DOUT) LED212.4(DIN)
LED12_DIN: LED212.2(DOUT) LED213.4(DIN)
LED13_DIN: LED213.2(DOUT) LED214.4(DIN)
LED14_DIN: LED214.2(DOUT) LED215.4(DIN)
LED15_DIN: LED215.2(DOUT) LED216.4(DIN)
LED16_DIN: LED216.2(DOUT) LED217.4(DIN)
LED17_DIN: LED217.2(DOUT) LED218.4(DIN)
LED18_DIN: LED218.2(DOUT) LED219.4(DIN)
LED19_DIN: LED219.2(DOUT) LED220.4(DIN)
LED20_DIN: LED220.2(DOUT) LED221.4(DIN)
LED21_DIN: LED221.2(DOUT) LED222.4(DIN)
LED22_DIN: LED222.2(DOUT) LED223.4(DIN)
LED23_DIN: LED223.2(DOUT) LED224.4(DIN)
LED24_DIN: LED224.2(DOUT) LED225.4(DIN)
LED25_DIN: LED225.2(DOUT) LED226.4(DIN)
LED26_DIN: LED226.2(DOUT) LED227.4(DIN)
LED27_DIN: LED227.2(DOUT) LED228.4(DIN)
LED28_BUF: U101.40(GPIO28_ADC2) U105.1(NC) U105.2(A)
LED28_DIN: LED229.4(DIN) U105.4(Y)
LED29_DIN: LED229.2(DOUT) LED230.4(DIN)
LED30_DIN: LED230.2(DOUT) LED231.4(DIN)
LIGHT_DET: C247.2 R135.1 R136.1 U101.39(GPIO27_ADC1)
QSPI_SCLK: U101.52(QSPI_SCLK) U104.6(CLK)
QSPI_SD0: U101.53(QSPI_SD0) U104.5(DI)
QSPI_SD1: U101.55(QSPI_SD1) U104.2(DO)
QSPI_SD2: U101.54(QSPI_SD2) U104.3(IO2)
QSPI_SD3: U101.51(QSPI_SD3) U104.7(IO3)
QSPI_SS: R124.2 U101.56(QSPI_SS) U104.1(CS#)
RESET_N: C127.2 R125.2 U101.26(RUN)
USB_N: R109.2 U101.46(USB_DM)
USB_P: R111.2 U101.47(USB_DP)
USER_BTN1: C244.2 R130.2 U101.18(GPIO15)
USER_BTN2: C245.2 R132.2 U101.17(GPIO14)
USER_BTN3: C246.2 R134.2 U101.16(GPIO13)
X_R: C124.1 R121.1 Y101.3
XIN: C123.1 R120.2 U101.20(XIN) Y101.1
XOUT: R120.1 R121.2 U101.21(XOUT)
$1N6734: J101.B5(CC2) R118.2
$1N6739: J101.A5(CC1) R119.2
$1N8227: R122.1 R124.1 SW101.3(C) SW101.4(D)
$1N8669: R123.1 R125.1 SW102.3(C) SW102.4(D)
$1N9334: LED102.1(A) R104.1
$1N23191: R129.1 R130.1 SW103.3 SW103.4
$1N23881: R131.1 R132.1 SW104.3 SW104.4
$1N24080: R133.1 R134.1 SW105.3 SW105.4
$2N19103: BUZZER1.1 C243.2 D105.1(K) R127.1
$2N19108: BUZZER1.2 D105.2(A) Q1.3(D)

Not connected (* = marked no-connect by the designer): J101 A8(SBU1)* B8(SBU2)*; LED228 2(DOUT)*; U101 2(GPIO0)* 3(GPIO1)* 4(GPIO2)* 5(GPIO3)* 6(GPIO4)* 7(GPIO5)* 8(GPIO6)* 9(GPIO7)* 11(GPIO8)* 15(GPIO12)* 24(SWCLK)* 25(SWD)* 27(GPIO16)* 28(GPIO17)* 30(GPIO19)* 31(GPIO20)* 32(GPIO21)* 34(GPIO22)* 35(GPIO23)* 36(GPIO24)* 37(GPIO25)* 38(GPIO26_ADC0)*; U106 1(CLKO)* 3(INT#)*

## Notes on the sheets
sheet 1
- Clock (Page 1/2)
- Power for LEDs
- 5V to 3V3
- MCU
- Power LED
- FLASH
- NF
- NF
- Level Translators
- USB Connector
- NF
- RTC Clock
- User Buttons
- BOOT Select Button
- Reset Button
- Light Sensor
- Note:
  Press RESET twice to
  go to boot mode to
  re-flash MCU.
- Note:
  Place on Bottom and then
  re-solder on Top, so we don't
  have to pay for TOP assembly,
  but we get the component.
- NF
- NF
sheet 2
- Clock (Page 2/2)
- SEGMENT LEDs
- IMPORTANT LINKS AND NOTES
  Links to design and build this clock:
  - Schematic and PCB: https://oshwlab.com/robertferanec/custom-keyboard
  - Github with all the files (SW + Board + Box): https://github.com/FEDEVEL/clock
  To build this clock:
  - Make the PCB and fit the components:
  https://github.com/FEDEVEL/clock/tree/main/Hardware/Manufacturing/PCB%20and%20Assembly
  - 3D print front panel and stand:
  https://github.com/FEDEVEL/clock/tree/main/Hardware/Manufacturing/Simple%20Box%20and%20Stand
  You will need to buy also:
  - Dimmable Adhesive Film Diffuser
  https://www.amazon.de/dp/B0DCW4CR3M/ref=pe_27091401_487027711_TE_SCE_dp_i1
  - M3x6 self tapping screws
  - CR1025 Lithium Button Cell Battery, 3 V, 30 mAh
  - Right angle USB-C cable
- DOTs + EXTERNAL LEDs
- NF
- Note:
  Here you can connect wires going to
  additional addressable LEDs.
- Mounting holes
- Buzzer
- Clock © 2025 by FEDEVEL
  is licensed under Creative Commons
  Attribution-NonCommercial-ShareAlike 4.0 International
  https://creativecommons.org/licenses/by-nc-sa/4.0/
- NF
- NF
